# Altium schematic sheet INTERNAL_REGULATORS.SchDoc
size E; SheetNumber: 4; SheetTotal: 5
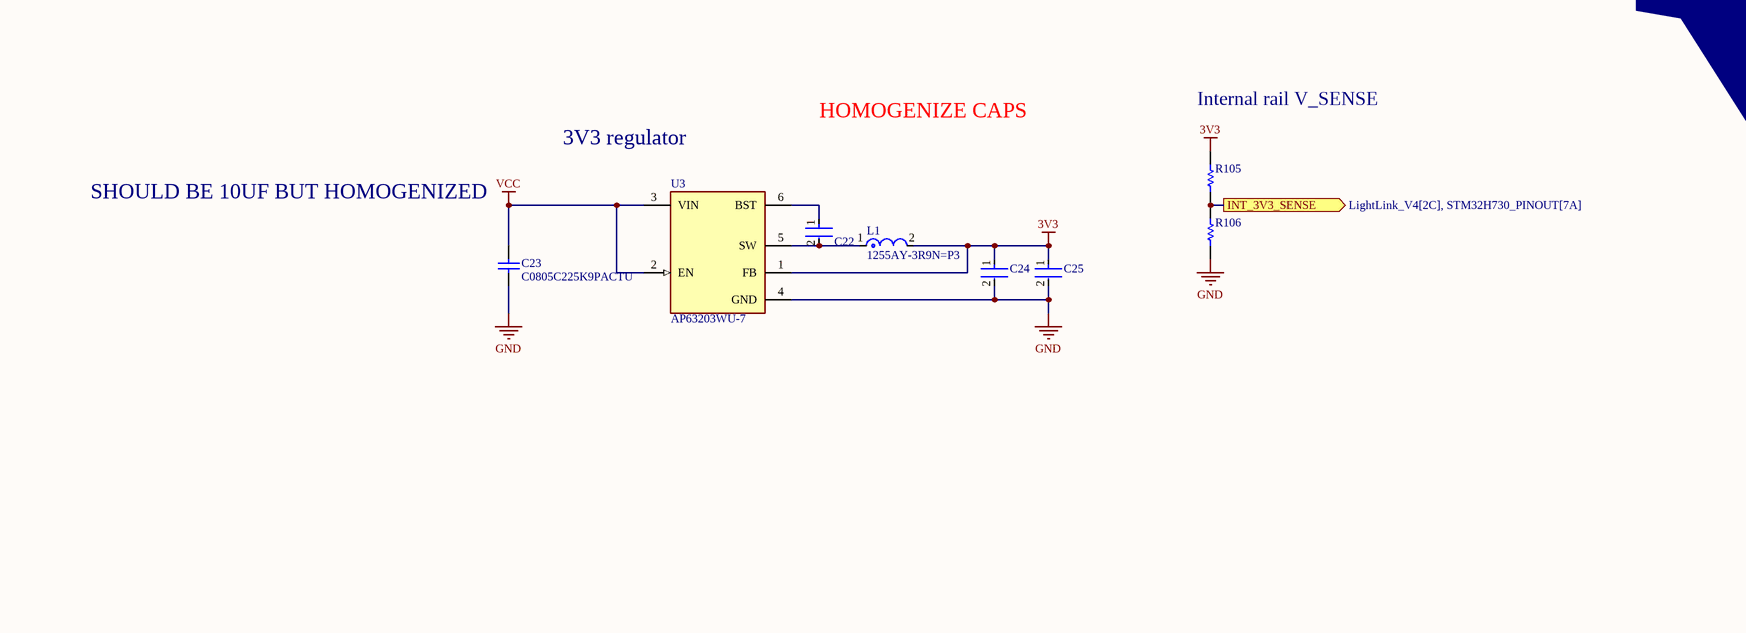
[diagram p0: INTERNAL_REGULATORS.SchDoc, top left]
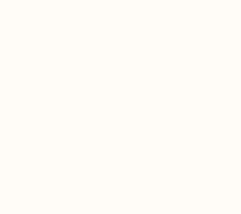
[diagram p1: INTERNAL_REGULATORS.SchDoc, bottom left]
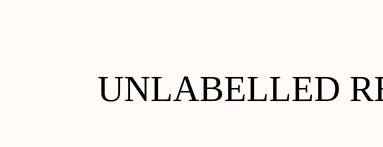
[diagram p2: INTERNAL_REGULATORS.SchDoc, bottom middle]

## Parts
C22  C0402C104K8PACTU  [FP-C0402-BB-MFG]  (value not drawn)
C23  C0805C225K9PACTU  [CAPC2013X145X50ML20T25]
C24  GRM21BR61E226ME44L  [FP-GRM21B-0_2-e0_2_0_7-IPC_B]  (value not drawn)
C25  GRM21BR61E226ME44L  [FP-GRM21B-0_2-e0_2_0_7-IPC_B]  (value not drawn)
L1  1255AY-3R9N=P3  [FP-DG6045C-MFG]
R105  ERJ3EKF1002V  [RESC1609X55X30LL15T15]  (value not drawn)
R106  ERJ3EKF1002V  [RESC1609X55X30LL15T15]  (value not drawn)
U3  AP63203WU-7  [FP-TSOT26-MFG]

## Ports
INT_3V3_SENSE (out, see LightLink_V4[2C], STM32H730_PINOUT[7A])

## Nets
3V3: C24.1 C25.1 L1.2 R105.2 U3.1(FB)
GND: C23.1 C24.2 C25.2 R106.1 U3.4(GND)
VCC: C23.2 U3.2(EN) U3.3(VIN)
INT_3V3_SENSE: R105.1 R106.2 ; port INT_3V3_SENSE
NetC22_1: C22.1 U3.6(BST)
NetC22_2: C22.2 L1.1 U3.5(SW)

## Notes on the sheet
- 3V3 regulator
- HOMOGENIZE CAPS
- Internal rail V_SENSE
- SHOULD BE 10UF BUT HOMOGENIZED
- Yep
- That's all folks
- UNLABELLED RESISTORS ARE 10K

## Library data of the parts
C22 = CMP-2008-02046-2: CAP CER 0.1UF 10V X5R 0402; Manufacturer: Kemet; Material: Ceramic; Capacitance: 0.10 μF; Temperature Coefficient: 15%; Tolerance: 0.1; Value: 0.10 μF; Package: C0402-BB; Temperature: -55°C to +125°C; ComponentLink2Description: Datasheet; Temperature Characteristic: X5R; Device Class L1: Passive Components; Height: 0.55mm; Lead Free: Yes; ComponentLink2URL: https://content.kemet.com/datasheets/KEM_C1002_X7R_SMD.pdf; Device Class L2: Capacitors; Temperature Range Low: -55°C; Temperature Range High: +125°C; RoHS: TRUE; Octopart: https://octopart.com/c0402c104k8pactu-kemet-140039; Automotive: No; Mouser Description: Capacitor 100 nF 10 VDC 0402; Category: Cap; Voltage Rating: 10 V; Digikey Description: CAP CER 0.1UF 10V X5R 0402; Ipc Land Pattern Name: CAPC10050X50; Device Class L3: Ceramic Capacitors; Manufacturer Part Number: C0402C104K8PACTU
C23 = CMP-1036-04819-2: Manufacturer: Kemet; Part Number: C0805C225K9PACTU
C24 C25 = CMP-2007-03222-3: Chip Multilayer Ceramic Capacitors for General Purpose, 0805, 22uF, X5R, 15%, 20%, 25V; Case/Package: 0805; Depth: 1.25mm; Resistor Type: Ceramic; Voltage Rating: 25V; Lead Free: Lead Free; Voltage Rating (DC): 25V; Case Code (Metric): 2012; Thickness: 0.057inch; REACH SVHC: No SVHC; Material: Ceramic; Tolerance: 20%; Length: 2mm; Capacitance: 22uF; Case Code (Imperial): 0805; Max Operating Temperature: 85°C; Termination: SMD/SMT; Weight: 0.000335oz; Dielectric: X5R; Packaging: Tape and Reel; Voltage: 25V; Package Quantity: 3000; Height: 1.25mm; Mount: Surface Mount; Width: 1.25mm; Min Operating Temperature: -55°C
L1 = CMP-06042-002684-1: Shielded Wirewound Inductor 3.9uH 30% 4200mA 0.0264Ω SMD; Saturation Current: 4.7A; Test Frequency: 100kHz; Core Material: Ferrite; Current Rating: 4.2A; DC Resistance (DCR): 26.4mR; Inductance: 3.9uH; Resistor Type: Wirewound; Width: 0.248inch; Mount: Surface Mount; Tolerance: 30%; Packaging: Tape and Reel; Max Operating Temperature: 85°C; Shielding: Shielded; Length: 0.248inch; Min Operating Temperature: -40°C; Height - Seated (Max): 0.177inch; Case/Package: Nonstandard
R105 R106 = CMP-1012-00623-3: Chip Resistor, 10 KOhm, +/- 1%, 0.1 W, -55 to 155 degC, 0603 (1608 Metric), RoHS, Tape and Reel; Manufacturer: Panasonic; Voltage Rating: 75V; Case\/Package: 0603; Power Rating: 100mW; Resistance: 10KOhm; Temperature Coefficient: 100ppm\/degreesC; Number of Pins: 2; Package Reference: 603; Depth: 0.8mm; Mount: SurfaceMount; Package Description: 2-Pin Surface Mount Device, Body 1.6 x 0.85 mm; Datasheet Version: 02/2017; Length: 1.6mm; Lead Free: LeadFree; Height: 0.45mm; Number of Terminations: 2; Max Power Dissipation: 100mW; Min Operating Temperature: -55degC; Datasheet URL: https://industrial.panasonic.com/cdbs/www-data/pdf/RDA0000/AOA0000C304.pdf; Termination: SMD/SMT; Case Code (Metric): 1608; Case Code (Imperial): 0603; Tolerance: 1%; Max Operating Temperature: 155degC; RoHSCompliant: true; Voltage Rating (DC): 75V; Radiation Hardening: No; Packaging: TapeandReel; Composition: ThickFilm; Mounting Technology: SurfaceMount; Manufacturer URL: http://www.panasonic.com/; Width: 0.031inch; REACH SVHC: NoSVHC; Contact Plating: Tin; Military Standard: Not; Package Quantity: 1
U3 = CMP-12757-000006-1: IC REG BUCK 3.3V 2A TSOT26; Manufacturer: Diodes Inc.; Output Type: Fixed; Min Supply Voltage: 3.8V; Number Of Outputs: 1; Max Junction Temp: +160°C; Nominal Supply Current: 22uA; Standoff Height: 0.01mm; Switching Frequency: 1.1MHz; Max Supply Voltage: 32V; ComponentLink2Description: Datasheet; Device Class L1: Integrated Circuits (ICs); Temperature: to +160°C; Device Class L3: Voltage Regulators - Switching; RoHS: TRUE; Octopart: https://octopart.com/ap63203wu-7-diodes+inc.-98099550; Output Voltage: 3.3V; Lead Free: Yes; ComponentLink2URL: https://www.diodes.com/assets/Datasheets/AP63200-AP63201-AP63203-AP63205.pdf; Digikey Description: IC REG BUCK 3.3V 2A TSOT26; Footprint Url: https://www.diodes.com/assets/Package-Files/TSOT26.pdf; Ambient Temperature Range High: +85°C; Height: 1mm; Automotive: No; Temperature Range High: +160°C; Switching Topology: Buck; Output Current: 2A; Package: TSOT26; Category: IC; Mouser Description: AP63203 Series 3.3 V 2 A SMT Fixed Low IQ Synchronous Buck - TSOT-26; Device Class L2: Power Management ICs; Ambient Temperature Range Low: -40°C; Manufacturer Part Number: AP63203WU-7